# Altium schematic sheet Sheet2.SchDoc
size A4
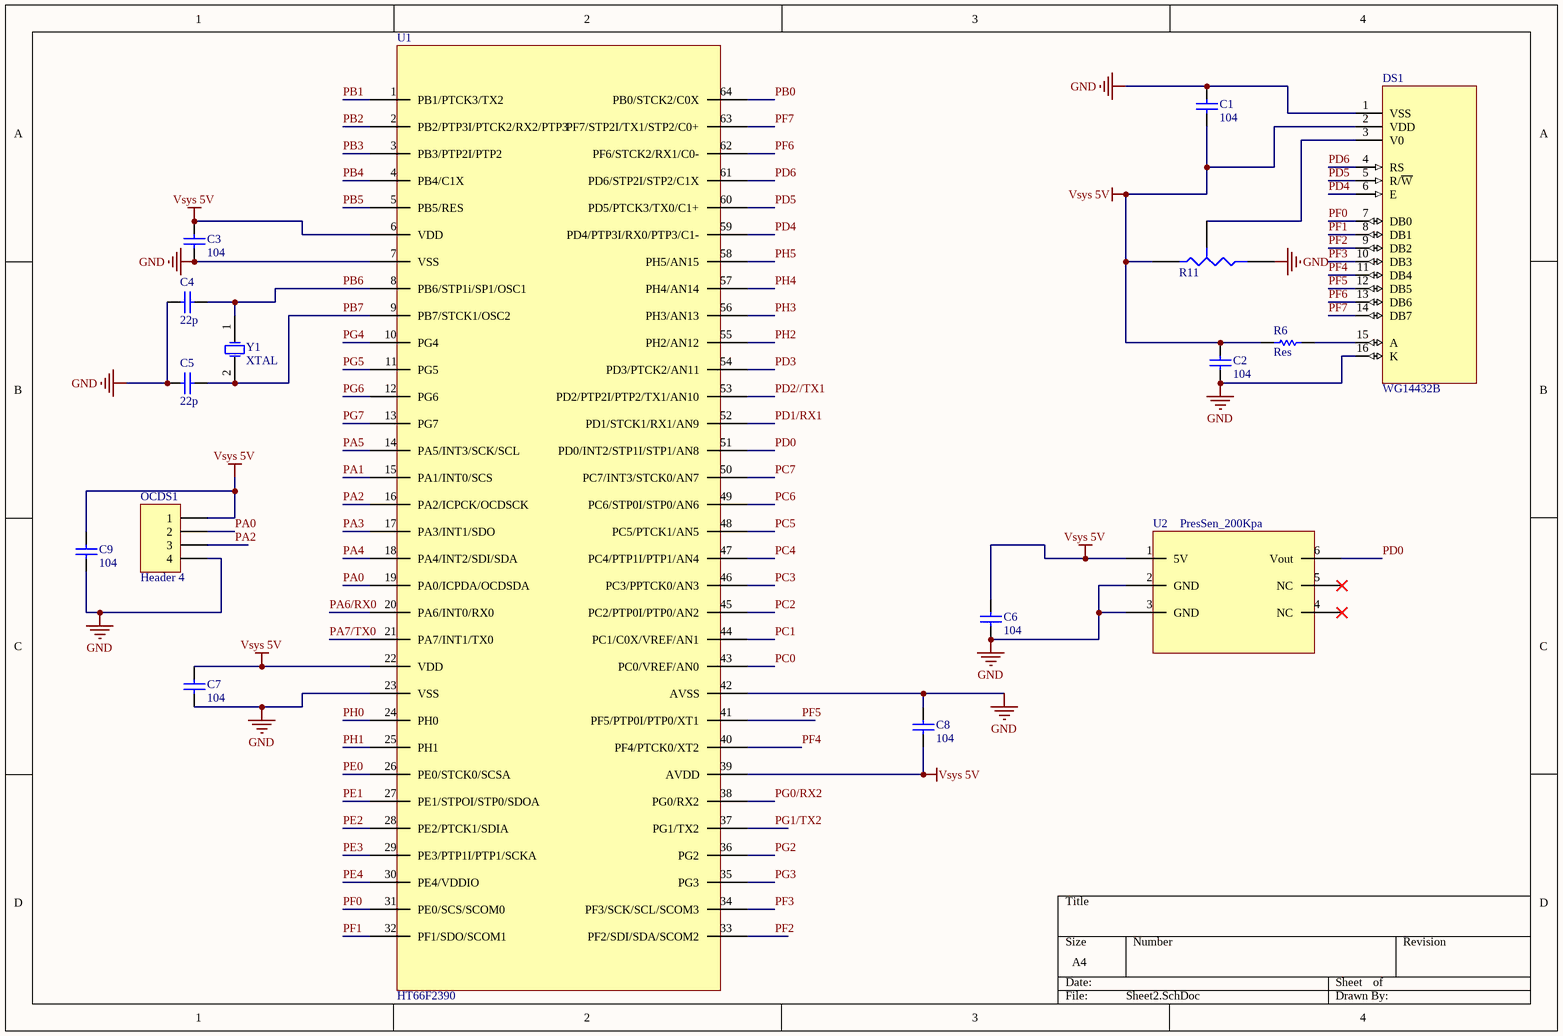
[diagram p0: Sheet2.SchDoc]

## Parts
C1  104  [C200]
C2  104  [C200]
C3  104  [C200]
C4  22p  [C200]
C5  22p  [C200]
C6  104  [C200]
C7  104  [C200]
C8  104  [C200]
C9  104  [C200]
DS1  WG14432B  [LCM_16]
OCDS1  Header 4  [HDR1X4]
R6  Res  [AXIAL-0.3]
R11  Res Tap  [VR3]  (value not drawn)
U1  HT66F2390  [LFPQ-64]
U2  PresSen_200Kpa  [RSCM17100Kxxxx]
Y1  XTAL  [XTAL4-8]

## Nets
GND: C1.2 C2.1 C3.1 C4.1 C5.1 C6.1 C7.1 C8.2 C9.1 DS1.1(VSS) DS1.16(K) OCDS1.4 R11.2(B) U1.7(VSS) U1.23(VSS) U1.42(AVSS) U2.2(GND) U2.3(GND)
Vsys 5V: C1.1 C2.2 C3.2 C6.2 C7.2 C8.1 C9.2 DS1.2(VDD) OCDS1.1 R6.1 R11.1(A) U1.6(VDD) U1.22(VDD) U1.39(AVDD) U2.1(5V)
PA0: OCDS1.2 U1.19(PA0/ICPDA/OCDSDA)
PA1: U1.15(PA1/INT0/SCS)
PA2: OCDS1.3 U1.16(PA2/ICPCK/OCDSCK)
PA3: U1.17(PA3/INT1/SDO)
PA4: U1.18(PA4/INT2/SDI/SDA)
PA5: U1.14(PA5/INT3/SCK/SCL)
PA6/RX0: U1.20(PA6/INT0/RX0)
PA7/TX0: U1.21(PA7/INT1/TX0)
PB0: U1.64(PB0/STCK2/C0X)
PB1: U1.1(PB1/PTCK3/TX2)
PB2: U1.2(PB2/PTP3I/PTCK2/RX2/PTP3)
PB3: U1.3(PB3/PTP2I/PTP2)
PB4: U1.4(PB4/C1X)
PB5: U1.5(PB5/RES)
PB6: C4.2 U1.8(PB6/STP1i/SP1/OSC1) Y1.1(OSC1)
PB7: C5.2 U1.9(PB7/STCK1/OSC2) Y1.2(OSC2)
PC0: U1.43(PC0/VREF/AN0)
PC1: U1.44(PC1/C0X/VREF/AN1)
PC2: U1.45(PC2/PTP0I/PTP0/AN2)
PC3: U1.46(PC3/PPTCK0/AN3)
PC4: U1.47(PC4/PTP1I/PTP1/AN4)
PC5: U1.48(PC5/PTCK1/AN5)
PC6: U1.49(PC6/STP0I/STP0/AN6)
PC7: U1.50(PC7/INT3/STCK0/AN7)
PD0: U1.51(PD0/INT2/STP1I/STP1/AN8) U2.6(Vout)
PD1/RX1: U1.52(PD1/STCK1/RX1/AN9)
PD2//TX1: U1.53(PD2/PTP2I/PTP2/TX1/AN10)
PD3: U1.54(PD3/PTCK2/AN11)
PD4: DS1.6(E) U1.59(PD4/PTP3I/RX0/PTP3/C1-)
PD5: DS1.5(R/~{W}) U1.60(PD5/PTCK3/TX0/C1+)
PD6: DS1.4(RS) U1.61(PD6/STP2I/STP2/C1X)
PE0: U1.26(PE0/STCK0/SCSA)
PE1: U1.27(PE1/STPOI/STP0/SDOA)
PE2: U1.28(PE2/PTCK1/SDIA)
PE3: U1.29(PE3/PTP1I/PTP1/SCKA)
PE4: U1.30(PE4/VDDIO)
PF0: DS1.7(DB0) U1.31(PE0/SCS/SCOM0)
PF1: DS1.8(DB1) U1.32(PF1/SDO/SCOM1)
PF2: DS1.9(DB2) U1.33(PF2/SDI/SDA/SCOM2)
PF3: DS1.10(DB3) U1.34(PF3/SCK/SCL/SCOM3)
PF4: DS1.11(DB4) U1.40(PF4/PTCK0/XT2)
PF5: DS1.12(DB5) U1.41(PF5/PTP0I/PTP0/XT1)
PF6: DS1.13(DB6) U1.62(PF6/STCK2/RX1/C0-)
PF7: DS1.14(DB7) U1.63(PF7/STP2I/TX1/STP2/C0+)
PG0/RX2: U1.38(PG0/RX2)
PG1/TX2: U1.37(PG1/TX2)
PG2: U1.36(PG2)
PG3: U1.35(PG3)
PG4: U1.10(PG4)
PG5: U1.11(PG5)
PG6: U1.12(PG6)
PG7: U1.13(PG7)
PH0: U1.24(PH0)
PH1: U1.25(PH1)
PH2: U1.55(PH2/AN12)
PH3: U1.56(PH3/AN13)
PH4: U1.57(PH4/AN14)
PH5: U1.58(PH5/AN15)
NetDS1_3: DS1.3(V0) R11.3(TAP)
NetDS1_15: DS1.15(A) R6.2

Not connected (* = marked no-connect by the designer): U2 4(NC)* 5(NC)*

## Library data of the parts
C1-C9 = Cap: Capacitor; Published: 8-Jun-2000; LatestRevisionDate: 17-Jul-2002; LatestRevisionNote: Re-released for DXP Platform.; PackageReference: RAD-0.3; Publisher: Altium Limited
DS1 = WG14432B: LCD Module
OCDS1 = Header 4: Header, 4-Pin; LatestRevisionDate: 17-Jul-2002; LatestRevisionNote: Re-released for DXP Platform.; Publisher: Altium Limited
R6 = Res: Resistor; Published: 8-Jun-2000; LatestRevisionDate: 17-Jul-2002; LatestRevisionNote: Re-released for DXP Platform.; PackageReference: AXIAL-0.3; Publisher: Altium Limited
R11 = Res Tap: Tapped Resistor; Sim Note: Enter the Resistance value and the set point into parameter fields.; Set Position: 0.5; Value: 1K; Published: 24-Mar-1999; LatestRevisionDate: 17-Jul-2002; LatestRevisionNote: Re-released for DXP Platform.; PackageReference: VR3; Publisher: Altium Limited; PackageDescription: Variable Resistor, Thru-Hole; 3 Leads
Y1 = XTAL: Crystal Oscillator; Published: 8-Jun-2000; LatestRevisionDate: 17-Jul-2002; LatestRevisionNote: Re-released for DXP Platform.; PackageReference: R38; Publisher: Altium Limited